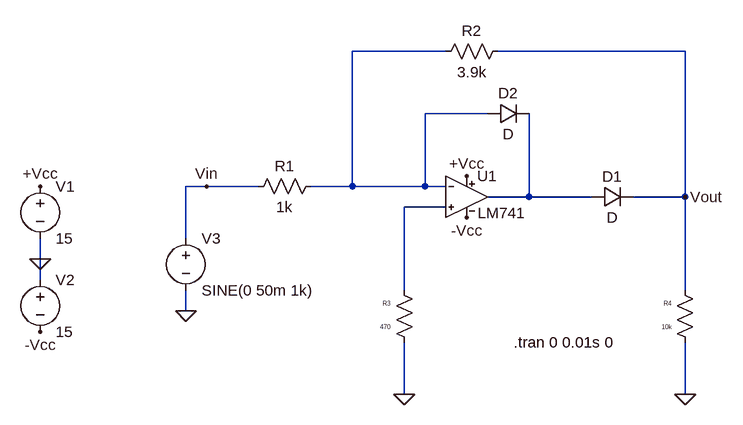
[diagram p0: schematic Halve Wave Rectifier.asc]
Halve Wave Rectifier.asc, the LTspice schematic file:
Version 4
SHEET 1 880 680
WIRE 176 -64 32 -64
WIRE 544 -64 256 -64
WIRE 240 32 144 32
WIRE -192 144 -224 144
WIRE -112 144 -192 144
WIRE 32 144 32 -64
WIRE 32 144 -32 144
WIRE 144 144 144 32
WIRE 144 144 32 144
WIRE 176 144 144 144
WIRE 304 160 304 32
WIRE 304 160 240 160
WIRE 400 160 304 160
WIRE 544 160 544 -64
WIRE 544 160 464 160
WIRE 176 176 112 176
WIRE -224 224 -224 144
WIRE -448 256 -448 224
WIRE -448 288 -448 256
WIRE 112 304 112 176
WIRE 544 304 544 160
WIRE -224 336 -224 304
WIRE 112 464 112 384
WIRE 544 464 544 384
FLAG -448 256 0
FLAG -448 144 +Vcc
FLAG -448 368 -Vcc
FLAG -224 336 0
FLAG 112 464 0
FLAG 544 464 0
FLAG 544 160 Vout
FLAG 208 128 +Vcc
FLAG 208 192 -Vcc
FLAG -192 144 Vin
SYMBOL LM741 208 96 R0
SYMATTR InstName U1
SYMBOL res -16 128 R90
WINDOW 0 0 56 VBottom 2
WINDOW 3 32 56 VTop 2
SYMATTR InstName R1
SYMATTR Value 1k
SYMBOL diode 400 176 R270
WINDOW 0 32 32 VTop 2
WINDOW 3 0 32 VBottom 2
SYMATTR InstName D1
SYMBOL res 272 -80 R90
WINDOW 0 0 56 VBottom 2
WINDOW 3 32 56 VTop 2
SYMATTR InstName R2
SYMATTR Value 3.9k
SYMBOL res 128 400 R180
WINDOW 0 36 76 Left 0
WINDOW 3 36 40 Left 0
SYMATTR InstName R3
SYMATTR Value 470
SYMBOL res 560 400 R180
WINDOW 0 36 76 Left 0
WINDOW 3 36 40 Left 0
SYMATTR InstName R4
SYMATTR Value 10k
SYMBOL voltage -448 128 R0
WINDOW 123 0 0 Left 0
WINDOW 39 0 0 Left 0
SYMATTR InstName V1
SYMATTR Value 15
SYMBOL voltage -448 272 R0
WINDOW 123 0 0 Left 0
WINDOW 39 0 0 Left 0
SYMATTR InstName V2
SYMATTR Value 15
SYMBOL voltage -224 208 R0
WINDOW 123 0 0 Left 0
WINDOW 39 0 0 Left 0
SYMATTR InstName V3
SYMATTR Value SINE(0 50m 1k)
SYMBOL diode 240 48 R270
WINDOW 0 32 32 VTop 2
WINDOW 3 0 32 VBottom 2
SYMATTR InstName D2
TEXT 280 384 Left 2 !.tran 0 0.01s 0

The netlist it stands for:
* Halve Wave Rectifier.asc
XU1 N003 N001 +Vcc -Vcc N002 LM741  ; pins In+ In- V+ V- OUT
R1 N001 Vin 1k
D1 N002 Vout D
R2 Vout N001 3.9k
R3 0 N003 470
R4 0 Vout 10k
V1 +Vcc 0 15
V2 0 -Vcc 15
V3 Vin 0 SINE(0 50m 1k)
D2 N001 N002 D
.model D D
.lib standard.dio
.tran 0 0.01s 0
.lib LM741.lib
.backanno
.end